# EAGLE design M203B (EAGLE 6.6.0)
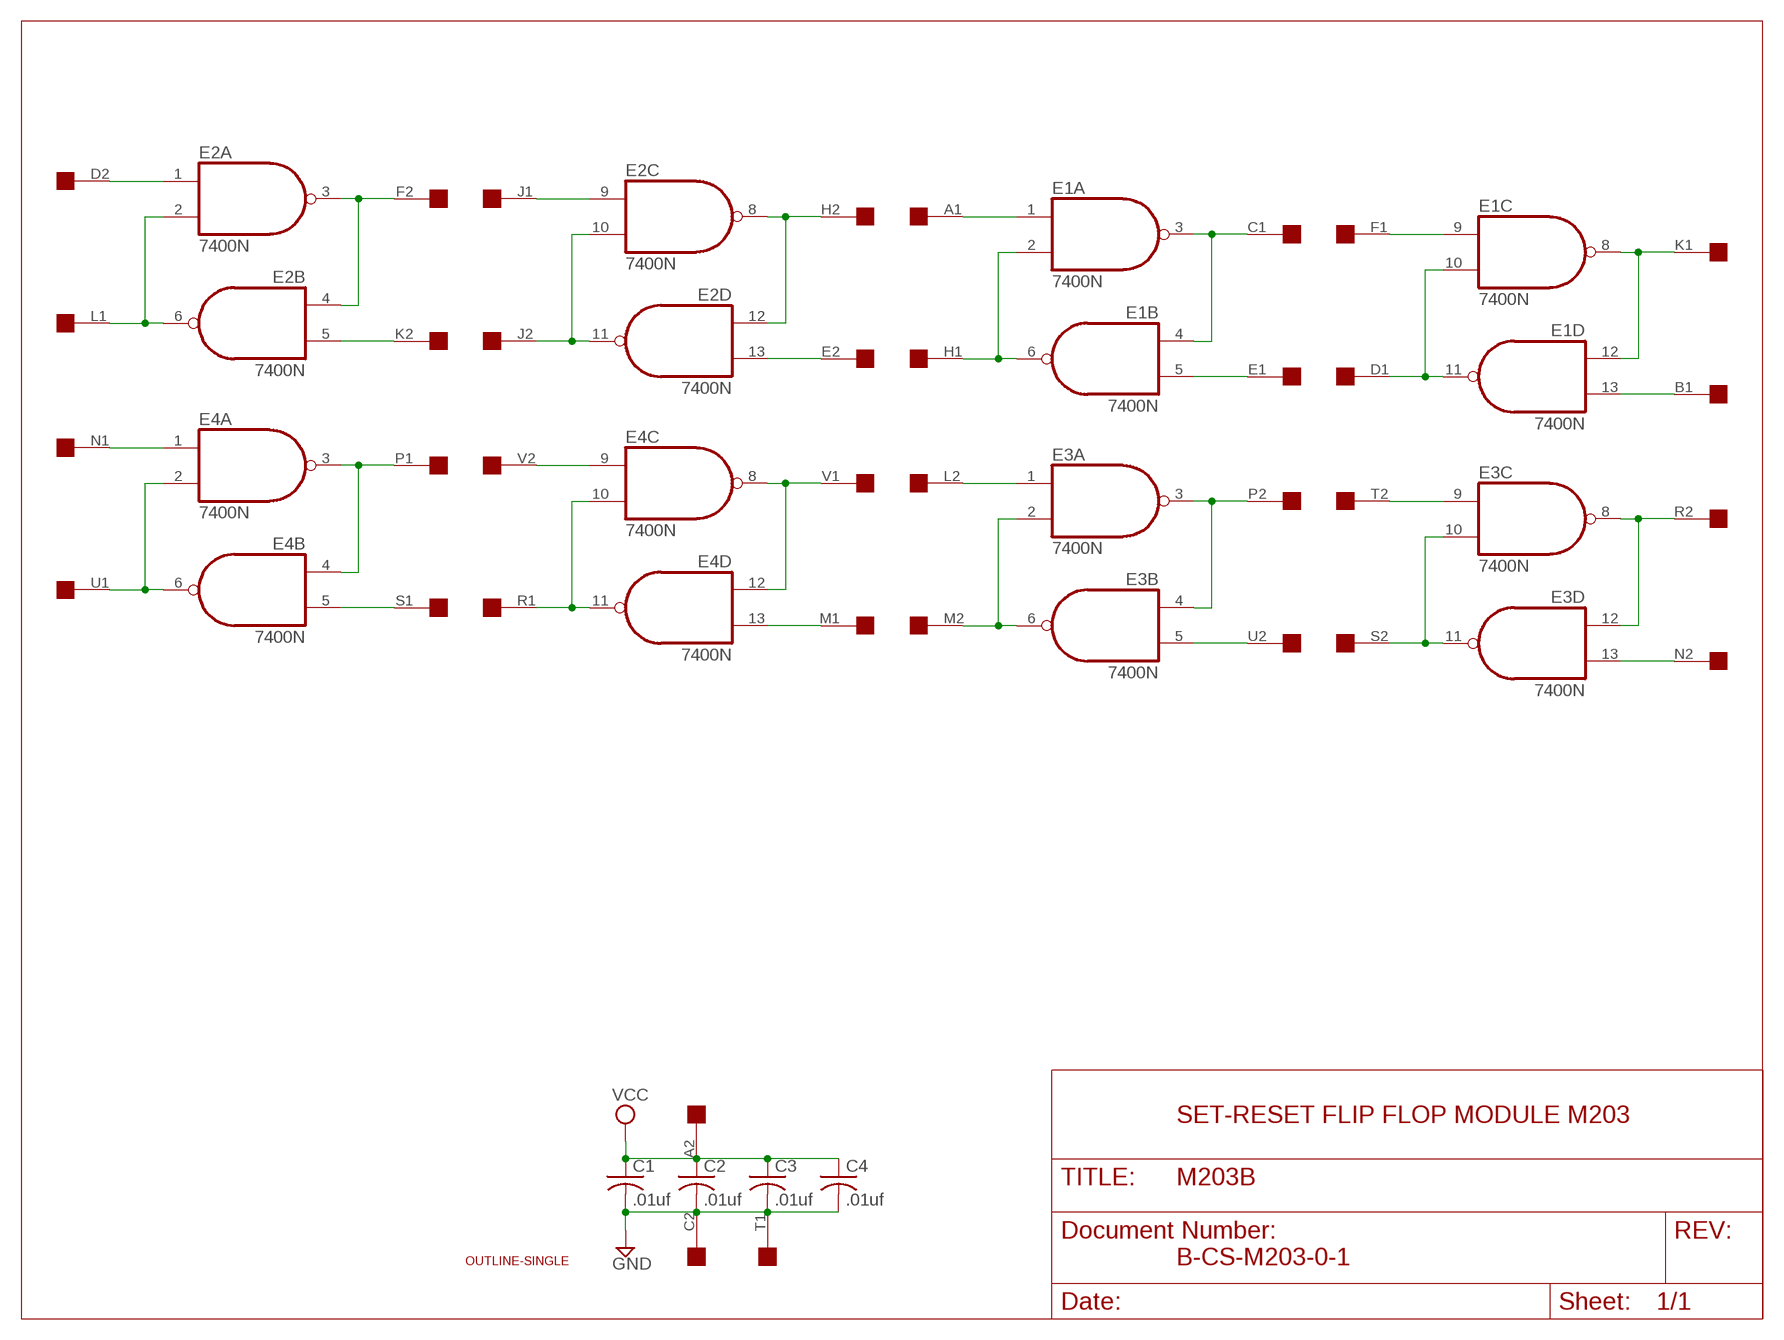
[diagram p0: schematic, sheet 1]

## Parts
C1  .01uf  C-US050-025X075  [C050-025X075]
C2  .01uf  C-US050-025X075  [C050-025X075]
C3  .01uf  C-US050-025X075  [C050-025X075]
C4  .01uf  C-US050-025X075  [C050-025X075]
E1  7400N  [DIL14]
E2  7400N  [DIL14]
E3  7400N  [DIL14]
E4  7400N  [DIL14]
U$1  OUTLINE-SINGLE  [SINGLE]
U$2  EDGE-2CONNECTOR  [EDGE-CON2]

## Nets
GND [Supply]: C1.2 C2.2 C3.2 C4.2 U$2.C2 U$2.T1
N$1: E1.2(A:I1) E1.6(B:O) U$2.H1
N$2: E1.3(A:O) E1.4(B:I0) U$2.C1
N$3: E1.1(A:I0) U$2.A1
N$4: E1.5(B:I1) U$2.E1
N$5: E1.10(C:I1) E1.11(D:O) U$2.D1
N$6: E1.8(C:O) E1.12(D:I0) U$2.K1
N$7: E1.13(D:I1) U$2.B1
N$8: E1.9(C:I0) U$2.F1
N$9: E2.2(A:I1) E2.6(B:O) U$2.L1
N$10: E2.3(A:O) E2.4(B:I0) U$2.F2
N$11: E2.1(A:I0) U$2.D2
N$12: E2.5(B:I1) U$2.K2
N$13: E2.10(C:I1) E2.11(D:O) U$2.J2
N$14: E2.8(C:O) E2.12(D:I0) U$2.H2
N$15: E2.13(D:I1) U$2.E2
N$16: E2.9(C:I0) U$2.J1
N$17: E3.2(A:I1) E3.6(B:O) U$2.M2
N$18: E3.3(A:O) E3.4(B:I0) U$2.P2
N$19: E3.1(A:I0) U$2.L2
N$20: E3.5(B:I1) U$2.U2
N$21: E3.10(C:I1) E3.11(D:O) U$2.S2
N$22: E3.8(C:O) E3.12(D:I0) U$2.R2
N$23: E3.13(D:I1) U$2.N2
N$24: E3.9(C:I0) U$2.T2
N$25: E4.2(A:I1) E4.6(B:O) U$2.U1
N$26: E4.3(A:O) E4.4(B:I0) U$2.P1
N$27: E4.1(A:I0) U$2.N1
N$28: E4.5(B:I1) U$2.S1
N$29: E4.10(C:I1) E4.11(D:O) U$2.R1
N$30: E4.8(C:O) E4.12(D:I0) U$2.V1
N$31: E4.13(D:I1) U$2.M1
N$32: E4.9(C:I0) U$2.V2
VCC [Supply]: C1.1 C2.1 C3.1 C4.1 U$2.A2
Unconnected: U$2.B2

## Notes on the sheet
- SET-RESET FLIP FLOP MODULE M203
- B-CS-M203-0-1

## Power pins joined to a net without a drawn wire
GND: E1.7(P:GND) E2.7(P:GND) E3.7(P:GND) E4.7(P:GND)
VCC: E1.14(P:VCC) E2.14(P:VCC) E3.14(P:VCC) E4.14(P:VCC)

## Library data of the parts
C1-C4 = rcl:C-US: CAPACITOR, American symbol
E1-E4 = 74xx-us:74*00: Quad 2-input NAND gate
U$1 = dec-con:OUTLINE-*: Board outlines for DEC boards.
U$2 = dec-con:EDGE-2: Double-Sided DEC edge connector.

## Net classes
1 Supply: width 0.813 mm

## Board
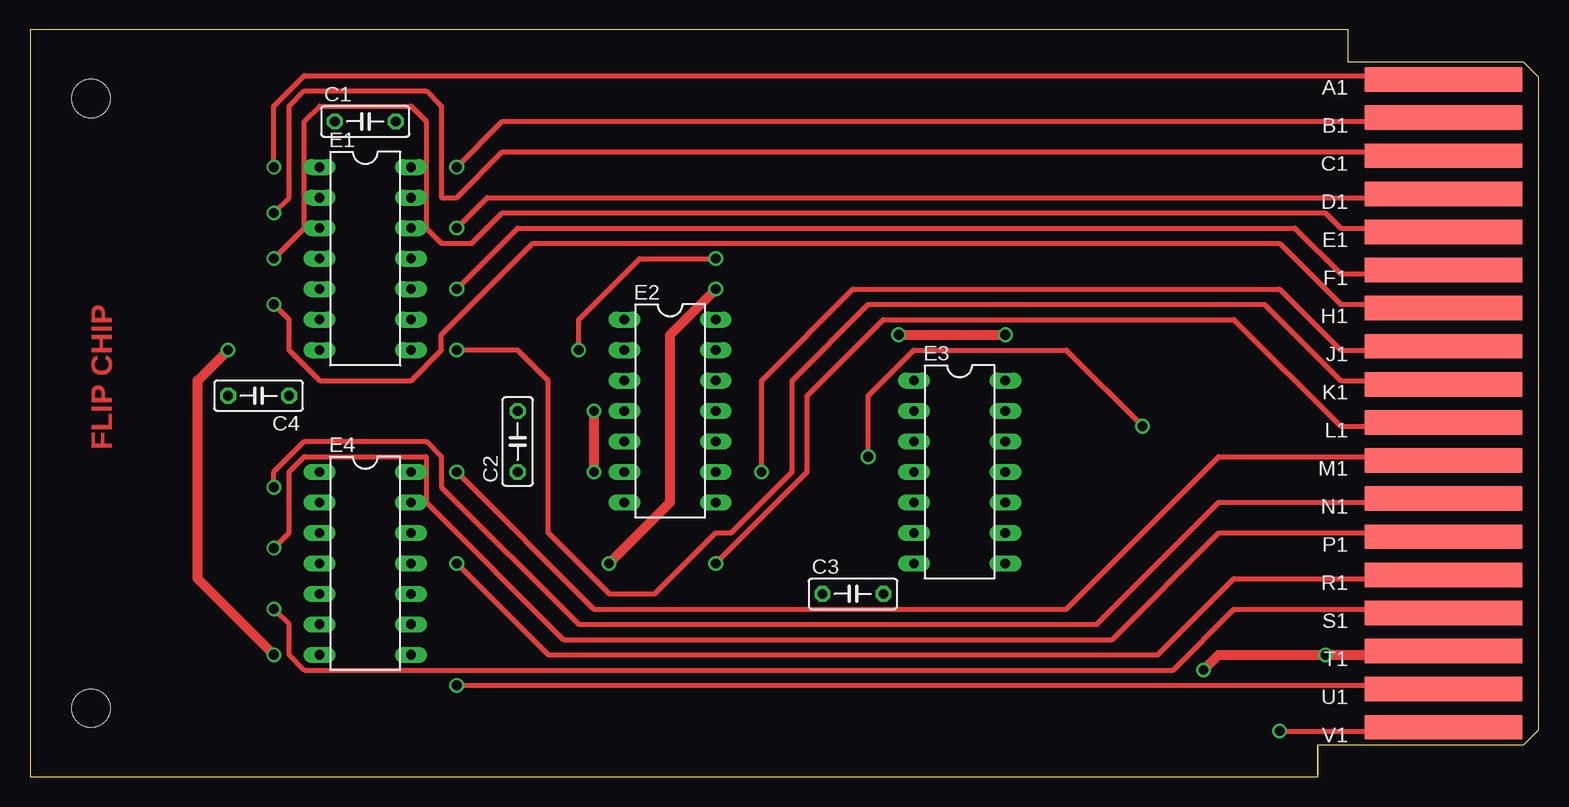
[diagram p1: board, top side]
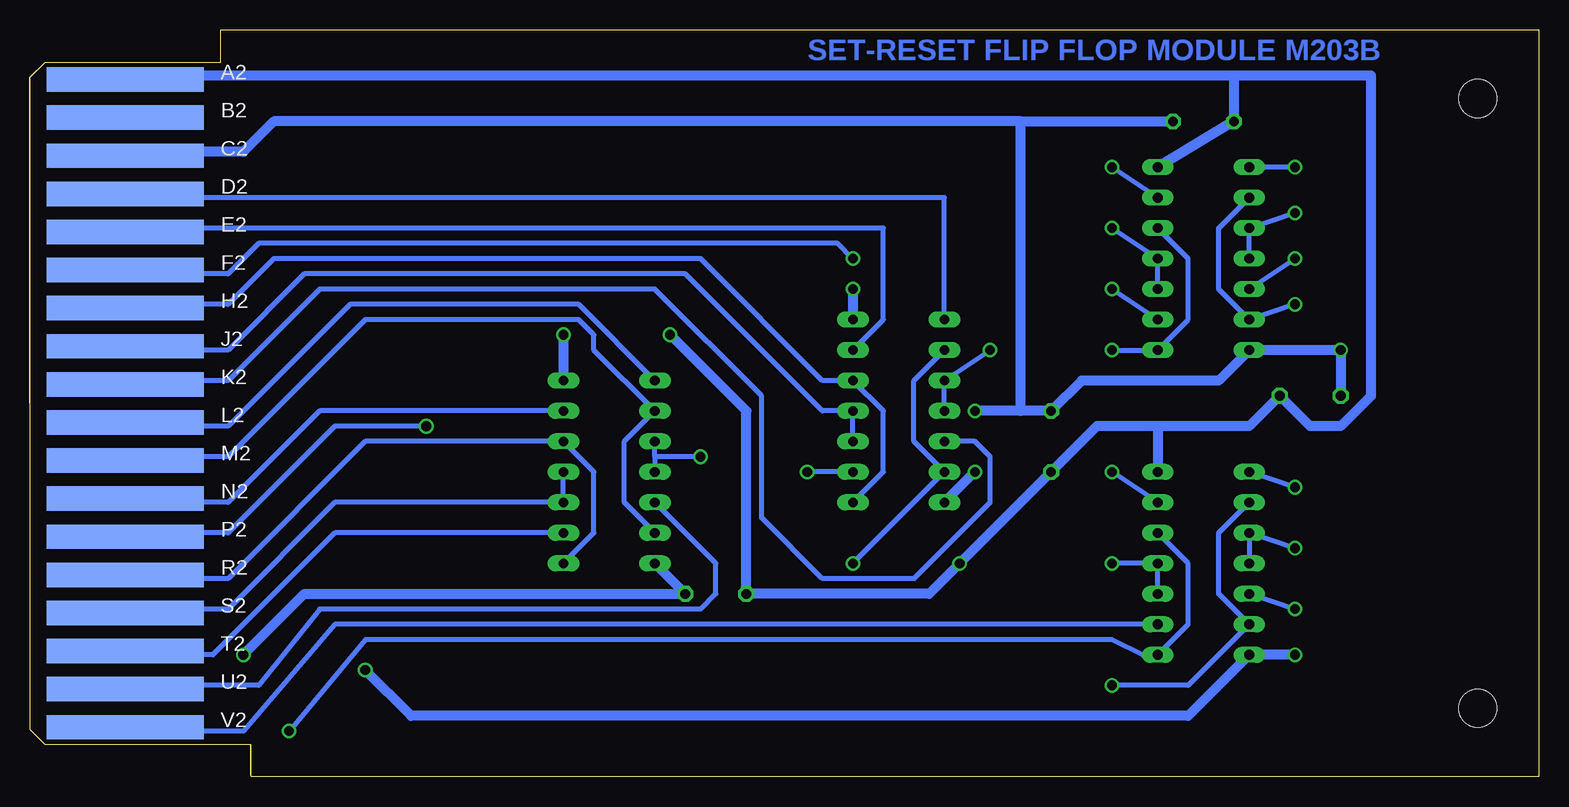
[diagram p2: board, bottom side, seen from below]

Size 125.73 x 62.23 mm. Coordinates in mm from the lower left corner, seen from the top.
Copper layers (1+16): Top 0.035mm / dielectric 1.5mm / Bottom 0.035mm
Design rules "16mils": minimum track width 16mil, minimum drill 32mil, track to track 15mil, track to pad 10mil, pad to pad 10mil, via to via 10mil, smd to smd 10mil, copper to edge 13mil, drill to drill 10mil, minimum pad ring 10mil, minimum via ring 8mil, stop-mask expansion 0mil, vias tented up to drill 0mil, thermal gap 10mil

### Footprints (pad centres in the part's own frame; a part is rotated, then mirrored left to right if it is on the bottom)
C050-025X075 = drill 0.813 octagon: 1 -2.54,0; 2 2.54,0
DIL14 = drill 0.813 long: 1 -7.62,-3.81; 2 -5.08,-3.81; 3 -2.54,-3.81; 4 0,-3.81; 5 2.54,-3.81; 6 5.08,-3.81; 7 7.62,-3.81; 8 7.62,3.81; 9 5.08,3.81; 10 2.54,3.81; 11 0,3.81; 12 -2.54,3.81; 13 -5.08,3.81; 14 -7.62,3.81
SINGLE = hole 3.175: 120.65,56.515; 120.65,5.715
EDGE-CON2 = smd 13.106 x 2.032: A1 7.938,4.128; B1 7.938,7.303; C1 7.938,10.477; D1 7.938,13.652; E1 7.938,16.828; F1 7.938,20.003; H1 7.938,23.177; J1 7.938,26.352; K1 7.938,29.527; L1 7.938,32.703; M1 7.938,35.877; N1 7.938,39.053; P1 7.938,42.227; R1 7.938,45.403; S1 7.938,48.578; T1 7.938,51.752; U1 7.938,54.928; V1 7.938,58.102 | smd 13.106 x 2.032 bottom: A2 7.938,4.128; B2 7.938,7.303; C2 7.938,10.477; D2 7.938,13.652; E2 7.938,16.828; F2 7.938,20.003; H2 7.938,23.177; J2 7.938,26.352; K2 7.938,29.527; L2 7.938,32.703; M2 7.938,35.877; N2 7.938,39.053; P2 7.938,42.227; R2 7.938,45.403; S2 7.938,48.578; T2 7.938,51.752; U2 7.938,54.928; V2 7.938,58.102

### Placement (x,y rotation side)
C1  27.94,54.61 0 top
C2  40.64,27.94 90 top
C3  68.58,15.24 0 top
C4  19.05,31.75 180 top
E1  27.94,43.18 270 top
E2  53.34,30.48 270 top
E3  77.47,25.4 270 top
E4  27.94,17.78 270 top
U$1  125.73,62.23 180 top
U$2  125.73,62.23 180 top

### Tracks (layer width: path | path; a pad name or v marks a point on that pad's centre or on a via)
GND  (via drill 0.81)
  Top 0.813: v46.99,30.48 v46.99,25.4 | v16.51,35.56 13.97,33.02 13.97,16.51 v20.32,10.16 | U$2.T1 111.76,10.16 v107.95,10.16 99.06,10.16 v97.79,8.89
  Bottom 0.813: U$2.C2 112.09,51.74 111.76,52.07 107.95,52.07 105.41,54.61 43.18,54.61 | 43.18,30.48 43.18,54.61 | 43.18,30.48 C2.2 38.1,33.02 26.67,33.02 E1.7 v16.51,35.56 C4.2 | 43.18,30.48 v46.99,30.48 | v46.99,25.4 E2.7 | v20.32,10.16 E4.7 29.21,5.08 93.98,5.08 v97.79,8.89 | 43.18,54.61 C1.2 | E3.7 C3.2 102.87,15.24 v107.95,10.16
N$1  (via drill 0.81)
  Top 0.406: v20.32,39.37 21.59,38.1 21.59,35.56 24.13,33.02 31.75,33.02 34.29,35.56 34.29,36.83 41.91,44.45 104.14,44.45 109.22,39.37 111.76,39.37 U$2.H1
  Bottom 0.406: E1.2 26.67,45.72 26.67,40.64 E1.6 v20.32,39.37
N$2  (via drill 0.81)
  Top 0.406: U$2.C1 111.76,52.07 39.37,52.07 35.56,48.26 34.29,48.26 34.29,55.88 33.02,57.15 22.86,57.15 21.59,55.88 21.59,48.26 v20.32,46.99
  Bottom 0.406: E1.4 E1.3 v20.32,46.99
N$3  (via drill 0.81)
  Top 0.406: U$2.A1 111.76,58.42 22.86,58.42 20.32,55.88 v20.32,50.8
  Bottom 0.406: v20.32,50.8 E1.1
N$4  (via drill 0.81)
  Top 0.406: v20.32,43.18 22.86,45.72 22.86,54.61 24.13,55.88 31.75,55.88 33.02,54.61 33.02,45.72 34.29,44.45 36.83,44.45 39.37,46.99 107.95,46.99 109.22,45.72 111.76,45.72 U$2.E1
  Bottom 0.406: E1.5 v20.32,43.18
N$5  (via drill 0.81)
  Top 0.406: U$2.D1 111.76,48.26 38.1,48.26 v35.56,45.72
  Bottom 0.406: E1.10 E1.11 v35.56,45.72
N$6  (via drill 0.81)
  Top 0.406: U$2.K1 111.76,33.02 109.22,33.02 102.87,39.37 69.85,39.37 63.5,33.02 63.5,25.4 58.42,20.32 57.15,20.32 52.07,15.24 48.26,15.24 43.18,20.32 43.18,33.02 40.64,35.56 v35.56,35.56
  Bottom 0.406: v35.56,35.56 E1.8 29.21,38.1 29.21,43.18 E1.12
N$7  (via drill 0.81)
  Top 0.406: U$2.B1 111.76,54.61 39.37,54.61 v35.56,50.8
  Bottom 0.406: E1.13 v35.56,50.8
N$8  (via drill 0.81)
  Top 0.406: U$2.F1 111.76,41.91 109.22,41.91 105.41,45.72 40.64,45.72 v35.56,40.64
  Bottom 0.406: E1.9 v35.56,40.64
N$9  (via drill 0.81)
  Top 0.406: U$2.L1 111.76,29.21 109.22,29.21 100.33,38.1 71.12,38.1 64.77,31.75 64.77,25.4 v57.15,17.78
  Bottom 0.406: E2.2 52.07,33.02 52.07,27.94 E2.6 v57.15,17.78
N$10  (via drill 0.81)
  Top 0.406: v45.72,35.56 45.72,38.1 50.8,43.18 v57.15,43.18
  Bottom 0.406: E2.4 E2.3 v45.72,35.56 | U$2.F2 111.76,41.91 109.22,41.91 106.68,44.45 58.42,44.45 v57.15,43.18
N$11
  Bottom 0.406: U$2.D2 111.76,48.26 49.53,48.26 E2.1
N$12
  Bottom 0.406: E2.5 46.99,27.94 45.72,26.67 45.72,22.86 52.07,16.51 59.69,16.51 64.77,21.59 64.77,31.75 73.66,40.64 101.6,40.64 109.22,33.02 111.76,33.02 U$2.K2
N$13
  Bottom 0.406: E2.10 E2.11 59.69,30.48 71.12,41.91 102.87,41.91 109.22,35.56 111.76,35.56 U$2.J2
N$14
  Bottom 0.406: E2.8 54.61,25.4 54.61,30.48 E2.12 59.69,33.02 69.85,43.18 105.41,43.18 109.22,39.37 111.76,39.37 U$2.H2
N$15
  Bottom 0.406: E2.13 54.61,38.1 54.61,45.72 111.76,45.72 U$2.E2
N$16  (via drill 0.81)
  Top 0.406: U$2.J1 111.76,35.56 109.22,35.56 104.14,40.64 68.58,40.64 60.96,33.02 v60.96,25.4
  Bottom 0.406: E2.9 v60.96,25.4
N$17
  Bottom 0.406: E3.6 76.2,22.86 76.2,27.94 E3.2 78.74,35.56 78.74,36.83 80.01,38.1 97.79,38.1 109.22,26.67 117.76,26.67 U$2.M2
N$18  (via drill 0.81)
  Top 0.406: v92.71,29.21 86.36,35.56 73.66,35.56 69.85,31.75 v69.85,26.67
  Bottom 0.406: 73.66,26.67 E3.4 | 73.66,26.67 E3.3 | U$2.P2 117.76,20.32 109.22,20.32 100.33,29.21 v92.71,29.21 | v69.85,26.67 73.66,26.67
N$19
  Bottom 0.406: E3.1 80.01,39.37 99.06,39.37 109.22,29.21 117.76,29.21 U$2.L2
N$20
  Bottom 0.406: U$2.U2 111.76,7.62 106.68,7.62 101.6,13.97 69.85,13.97 68.58,15.24 68.58,17.78 E3.5
N$21
  Bottom 0.406: E3.11 E3.10 100.33,22.86 109.22,13.97 117.78,13.97 U$2.S2
N$22
  Bottom 0.406: E3.8 78.74,20.32 78.74,25.4 E3.12 97.79,27.94 109.22,16.51 117.76,16.51 U$2.R2
N$23
  Bottom 0.406: U$2.N2 117.76,22.86 109.22,22.86 101.6,30.48 E3.13
N$24
  Bottom 0.406: U$2.T2 117.76,10.16 110.49,10.16 100.33,20.32 E3.9
N$25  (via drill 0.81)
  Top 0.406: U$2.U1 111.76,7.62 v35.56,7.62
  Bottom 0.406: E4.2 26.67,20.32 26.67,15.24 E4.6 29.21,7.62 v35.56,7.62
N$26  (via drill 0.81)
  Top 0.406: v20.32,19.05 21.59,20.32 21.59,25.4 22.86,26.67 33.02,26.67 33.02,22.86 44.45,11.43 90.17,11.43 99.06,20.32 111.76,20.32 U$2.P1
  Bottom 0.406: E4.4 E4.3 v20.32,19.05
N$27  (via drill 0.81)
  Top 0.406: v20.32,24.13 20.32,25.4 22.86,27.94 33.02,27.94 34.29,26.67 34.29,24.13 45.72,12.7 88.9,12.7 99.06,22.86 111.76,22.86 U$2.N1
  Bottom 0.406: v20.32,24.13 E4.1
N$28  (via drill 0.81)
  Top 0.406: v20.32,13.97 21.59,12.7 21.59,10.16 22.86,8.89 95.25,8.89 100.33,13.97 111.76,13.97 U$2.S1
  Bottom 0.406: v20.32,13.97 E4.5
N$29  (via drill 0.81)
  Top 0.406: U$2.R1 111.76,16.51 100.33,16.51 93.98,10.16 43.18,10.16 v35.56,17.78
  Bottom 0.406: E4.10 E4.11 v35.56,17.78
N$30  (via drill 0.81)
  Top 0.406: U$2.V1 111.76,3.81 v104.14,3.81
  Bottom 0.406: E4.12 29.21,17.78 29.21,12.7 E4.8 33.02,10.16 35.56,11.43 97.79,11.43 v104.14,3.81
N$31  (via drill 0.81)
  Top 0.406: U$2.M1 111.76,26.67 99.06,26.67 86.36,13.97 46.99,13.97 v35.56,25.4
  Bottom 0.406: E4.13 v35.56,25.4
N$32
  Bottom 0.406: U$2.V2 111.76,3.81 107.95,3.81 100.33,12.7 E4.9
VCC  (via drill 0.81)
  Top 0.813: v72.39,36.83 v81.28,36.83 | v57.15,40.64 53.34,36.83 53.34,22.86 v48.26,17.78
  Bottom 0.813: U$2.A2 111.76,58.02 111.76,58.42 25.4,58.42 | 25.4,58.42 13.97,58.42 13.97,31.75 16.51,29.21 19.05,29.21 C4.1 24.13,29.21 31.75,29.21 | 31.75,29.21 36.83,29.21 C2.1 v48.26,17.78 50.8,15.24 C3.1 66.04,30.48 v72.39,36.83 | 31.75,29.21 E4.14 | 25.4,58.42 C1.1 E1.14 | v81.28,36.83 E3.14 | v57.15,40.64 E2.14

### Text on the board
Top: FLIP CHIP
Bottom: SET-RESET FLIP FLOP MODULE M203B